# EasyEDA Pro project 物流车.eprj

# Schematic Schematic1
Create Date: 2023-06-04; Page Name: P1; Project Name: 物流车; Schematic Name: Schematic1; Update Date: 2023-06-04; Company: 嘉立创EDA; Page Size: A4; Version: V1.0
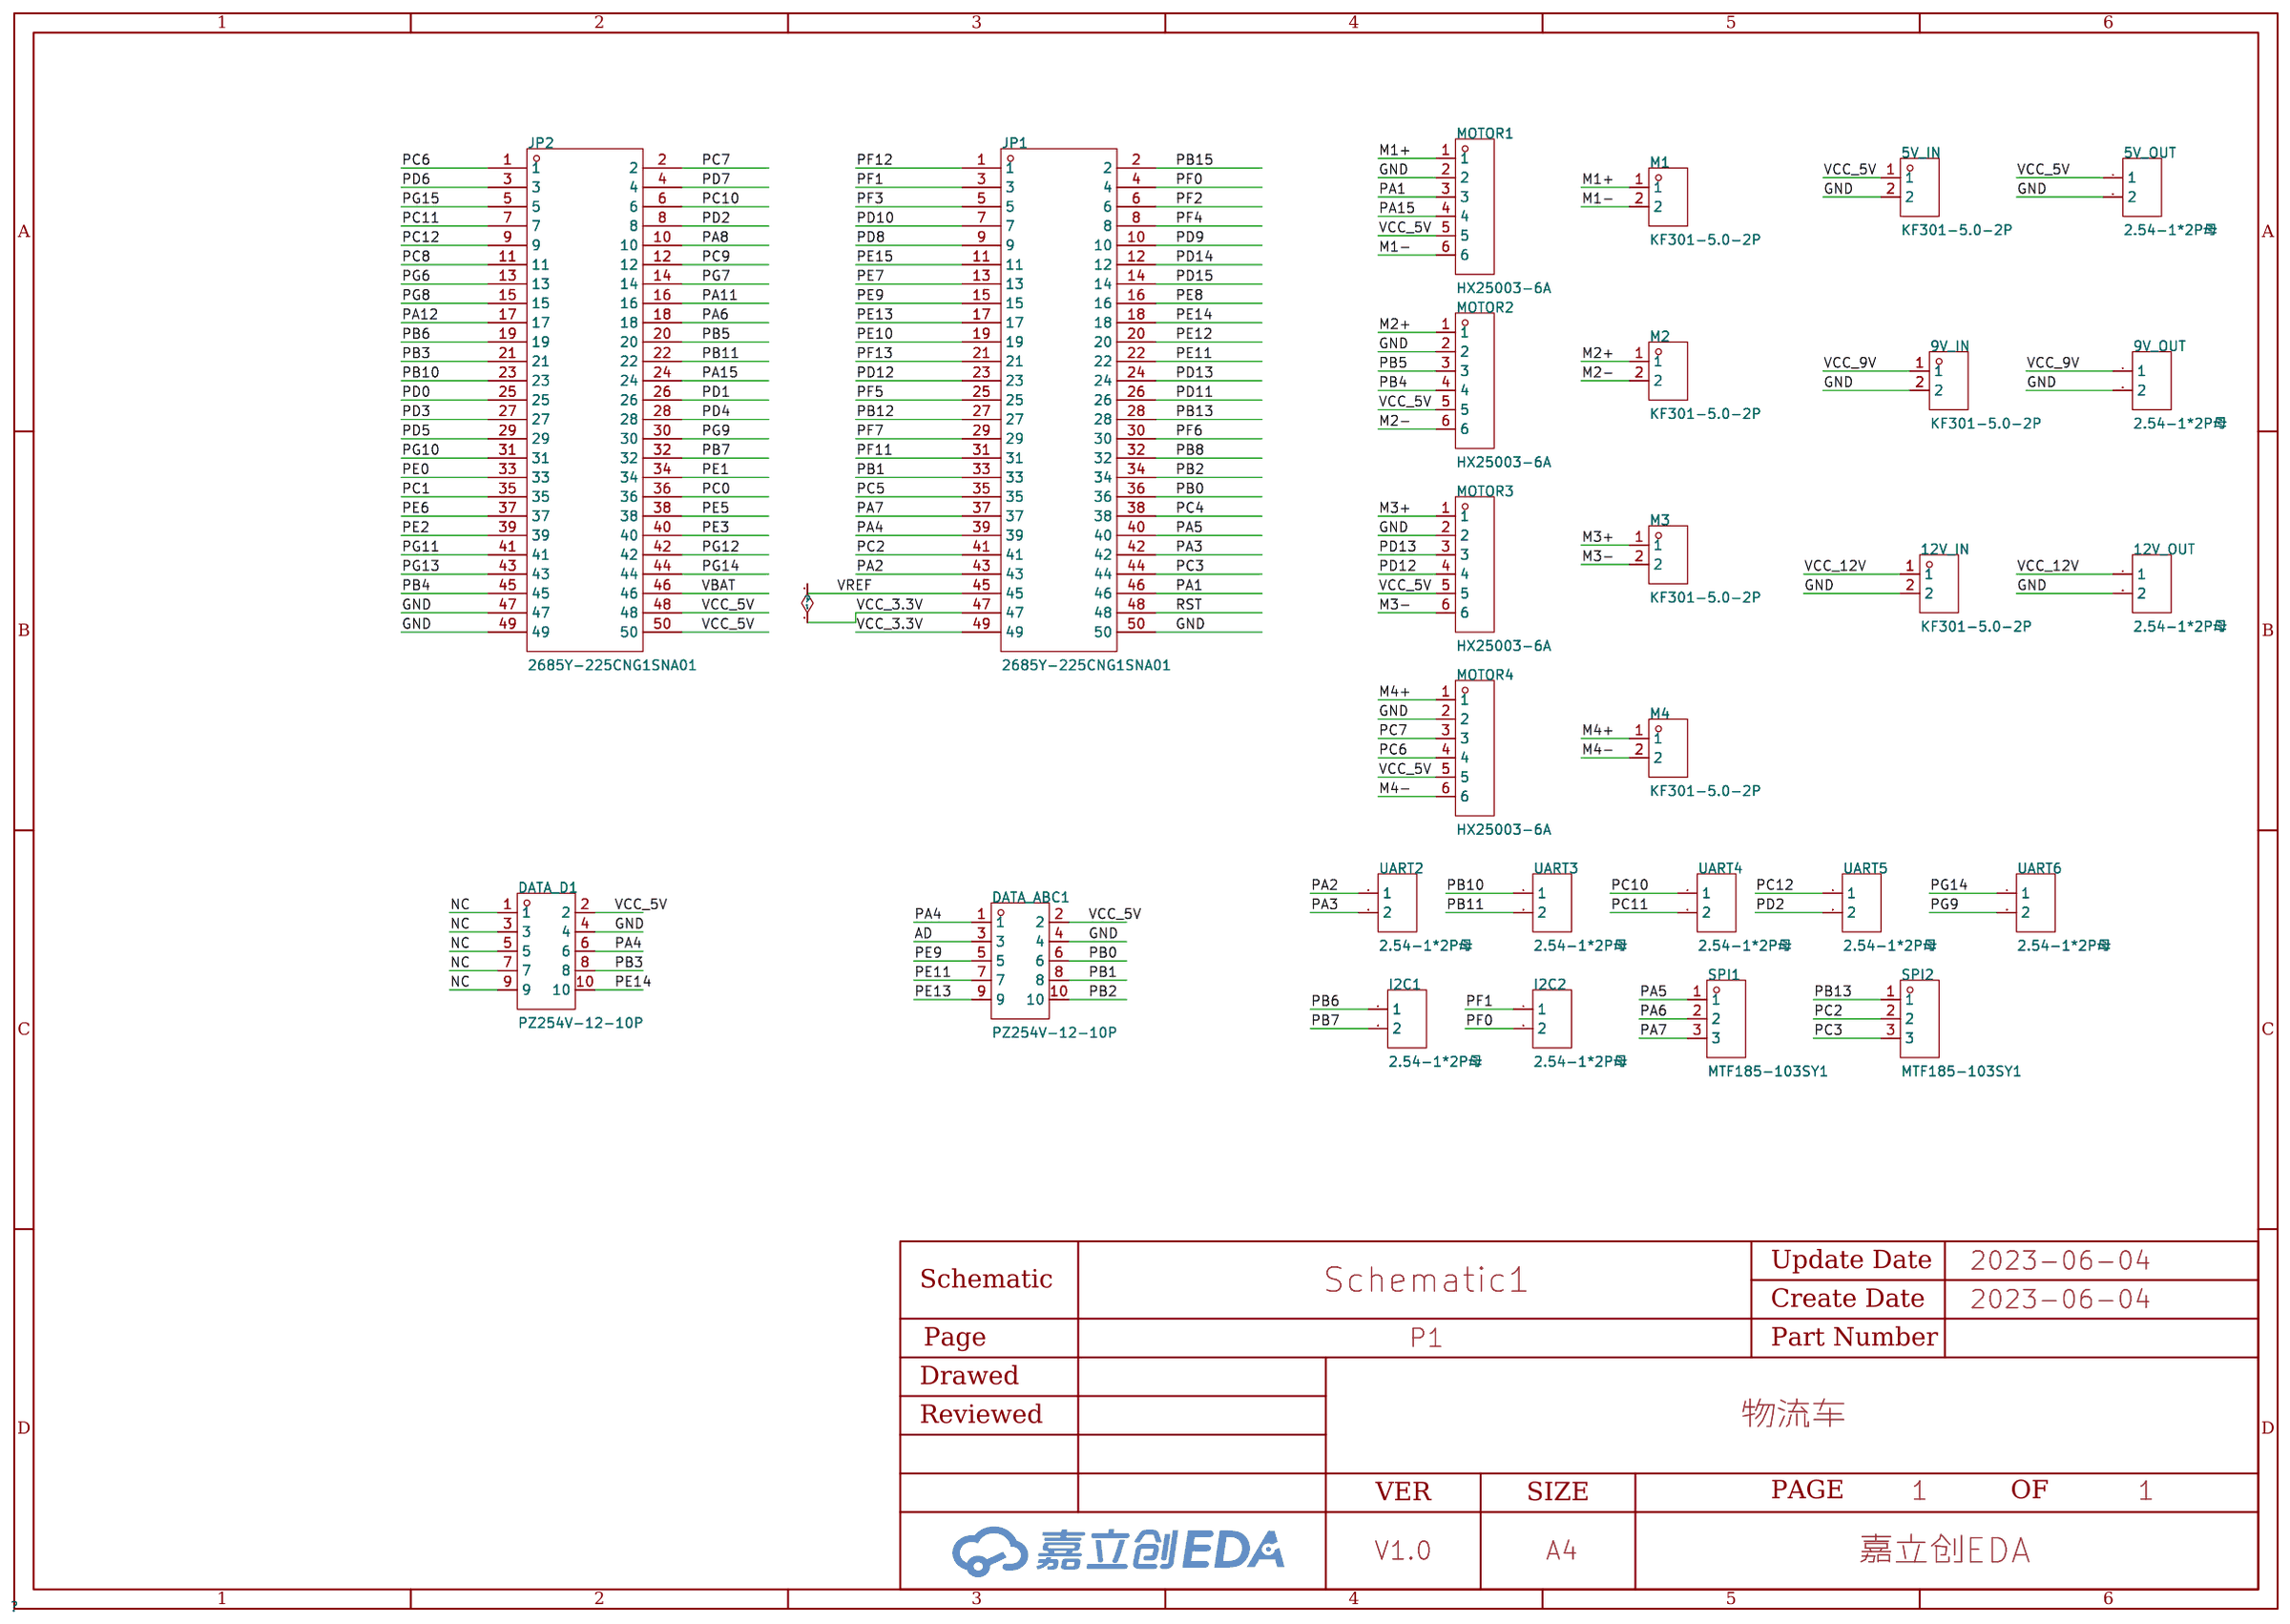
[diagram p0: schematic sheet]

## Parts
5V_IN  KF301-5.0-2P  [CONN-TH_P5.00_KF301-5.0-2P]
5V_OUT  2.54-1*2P母  [HDR-TH_2P-P2.54-V-F]
9V_IN  KF301-5.0-2P  [CONN-TH_P5.00_KF301-5.0-2P]
9V_OUT  2.54-1*2P母  [HDR-TH_2P-P2.54-V-F]
12V_IN  KF301-5.0-2P  [CONN-TH_P5.00_KF301-5.0-2P]
12V_OUT  2.54-1*2P母  [HDR-TH_2P-P2.54-V-F]
DATA_ABC1  PZ254V-12-10P  [HDR-TH_10P-P2.54-V-M-R2-C5-S2.54]
DATA_D1  PZ254V-12-10P  [HDR-TH_10P-P2.54-V-M-R2-C5-S2.54]
I2C1  2.54-1*2P母  [HDR-TH_2P-P2.54-V-F]
I2C2  2.54-1*2P母  [HDR-TH_2P-P2.54-V-F]
JP1  2685Y-225CNG1SNA01  [HDR-TH_50P-P2.54-V-F-R2-C25-S2.54-1]
JP2  2685Y-225CNG1SNA01  [HDR-TH_50P-P2.54-V-F-R2-C25-S2.54-1]
M1  KF301-5.0-2P  [CONN-TH_P5.00_KF301-5.0-2P]
M2  KF301-5.0-2P  [CONN-TH_P5.00_KF301-5.0-2P]
M3  KF301-5.0-2P  [CONN-TH_P5.00_KF301-5.0-2P]
M4  KF301-5.0-2P  [CONN-TH_P5.00_KF301-5.0-2P]
MOTOR1  HX25003-6A  [CONN-TH_6P-P2.50_HX25003-6A]
MOTOR2  HX25003-6A  [CONN-TH_6P-P2.50_HX25003-6A]
MOTOR3  HX25003-6A  [CONN-TH_6P-P2.50_HX25003-6A]
MOTOR4  HX25003-6A  [CONN-TH_6P-P2.50_HX25003-6A]
SPI1  MTF185-103SY1  [HDR-TH_3P-P2.54-V-F]
SPI2  MTF185-103SY1  [HDR-TH_3P-P2.54-V-F]
UART2  2.54-1*2P母  [HDR-TH_2P-P2.54-V-F]
UART3  2.54-1*2P母  [HDR-TH_2P-P2.54-V-F]
UART4  2.54-1*2P母  [HDR-TH_2P-P2.54-V-F]
UART5  2.54-1*2P母  [HDR-TH_2P-P2.54-V-F]
UART6  2.54-1*2P母  [HDR-TH_2P-P2.54-V-F]

## Library data of the parts
5V_IN 9V_IN 12V_IN M1-M4 = KF301-5.0-2P: 间距:5mm;排数:1;每排PIN数:2;安装方式:直针;额定电流:17A;额定电压:250V;线规 - AWG:14~22;线规 - mm?:1.5;工作温度范围:-30℃~+120℃;颜色:蓝色;; LCSC Part Name: 5mm 排数:1 每排P数:2 直针 可拼接 铜 环保; Supplier Part: C474881; Manufacturer: KEFA(科发); Supplier Footprint: 直插,P=5mm; JLCPCB Part Class: Extended Part; Datasheet: https://atta.szlcsc.com/upload/public/pdf/source/20200115/C474881_883EFE2003339C40FD1BEEEFC9A18423.pdf; Supplier: LCSC; Pitch: 5mm; Number of Rows: 1; Number of PINs Per Row: 2; Mounting Style: 直针; Current Rating (Max): 17A; Voltage Rating (Max): 250V; Wire Gauge - AWG: 14~22; Wire Gauge - mm?: 1.5; Operating Temperature Range: -30℃~+120℃; Color: 蓝色
5V_OUT 9V_OUT 12V_OUT I2C1 I2C2 UART2-UART6 = 2.54-1*2P母: 排数:单排;总孔位数:2;间距:2.54mm;插孔结构:1x2P;行距:-;安装类型:直插;塑高:-;触头材质:-;触头镀层:-;; LCSC Part Name: 2.54mm 1x2P; Supplier Part: C49661; Manufacturer: BOOMELE(博穆精密); Supplier Footprint: 直插,P=2.54mm; JLCPCB Part Class: Extended Part; Datasheet: https://atta.szlcsc.com/upload/public/pdf/source/20151109/1457707570988.pdf; Supplier: LCSC; Number of Rows: 单排; Number of Holes: 2; Pitch: 2.54mm; Holes Structure: 1x2P; Mounting Type: 直插
DATA_ABC1 DATA_D1 = PZ254V-12-10P: 排数:双排;总PIN位数:10;间距:2.54mm;插针结构:2x5P;行距:2.54mm;安装类型:直插;圆针/方针:方针;额定电流:-;额定电压:-;配合针长度:6mm;塑高:2.5mm;端接针长度:3mm;触头材质:黄铜;触头镀层:-;工作温度范围:-40℃~+105℃;颜色:黑色;; LCSC Part Name: 2.54mm 2x5P 直插 方针; Supplier Part: C492422; Manufacturer: XFCN(兴飞); Supplier Footprint: 插件,P=2.54mm; JLCPCB Part Class: Extended Part; Datasheet: https://atta.szlcsc.com/upload/public/pdf/source/20200309/C492422_5020CEA01BE7051F9EA9DD81AB0A25E3.pdf; Supplier: LCSC; Number of Rows: 双排; Number of Pins: 10; Pitch: 2.54mm; Pin Structure: 2x5P; Row Spacing: 2.54mm; Mounting Type: 直插; Circluar Pins/Square Pins: 方针; Length of Mating Pin: 6mm; Insulation Height: 2.5mm; Length of End Connection Pin: 3mm; Contact Material: 黄铜; Operating Temperature Range: -40℃~+105℃; Color: 黑色
JP1 JP2 = 2685Y-225CNG1SNA01: 排数:双排;总孔位数:50;间距:2.54mm;插孔结构:2x25P;行距:2.54mm;安装类型:直插;塑高:-;触头材质:黄铜;触头镀层:-;; LCSC Part Name: 2.54mm 2x25P Y型//环保耐高温/镀金; Supplier Part: C350296; Manufacturer: 华宇创; Supplier Footprint: 插件,P=2.54mm; JLCPCB Part Class: Extended Part; Datasheet: https://atta.szlcsc.com/upload/public/pdf/source/20181220/C350296_D2530F60C4B7AD26B2D0A354C76F8429.pdf; Supplier: LCSC; Number of Rows: 双排; Number of Holes: 50; Pitch: 2.54mm; Holes Structure: 2x25P; Row Spacing: 2.54mm; Mounting Type: 直插; Contact Material: 黄铜
MOTOR1-MOTOR4 = HX25003-6A: 参考系列:XH;间距:2.5mm;插针结构:1x6P;排数:1;每排PIN数:6;行距:-;公母:公型插针;安装方式:直插;额定电流:-;工作温度范围:-;; LCSC Part Name: XH 2.5mm 1x6P 直插 母座; Supplier Part: C442303; Manufacturer: HX(红星); Supplier Footprint: 插件,P=2.5mm; JLCPCB Part Class: Extended Part; Datasheet: https://atta.szlcsc.com/upload/public/pdf/source/20191028/C442303_23C4B7729FA712B9F535CAFD67C62AAB.pdf; Supplier: LCSC; Reference Series: XH; Pitch: 2.5mm; Pins Structure: 1x6P; Number of Rows: 1; Number of PINs Per Row: 6; Gender: 公型插针; Mounting Style: 直插
SPI1 SPI2 = MTF185-103SY1: 排数:单排;总孔位数:3;间距:2.54mm;插孔结构:1x3P;行距:-;安装类型:直插;塑高:-;触头材质:-;触头镀层:金;; LCSC Part Name: 2.54mm 1x3P; Supplier Part: C358717; Manufacturer: MINTRON(明硕); Supplier Footprint: 插件,P=2.54mm; JLCPCB Part Class: Extended Part; Datasheet: https://atta.szlcsc.com/upload/public/pdf/source/20190124/C358717_1CD3D4F6D9EF88A46E6D33CC99B8A53E.pdf; Supplier: LCSC; Number of Rows: 单排; Number of Holes: 3; Pitch: 2.54mm; Holes Structure: 1x3P; Mounting Type: 直插; Contact Plating: 金

## Nets
GND: 5V_IN.2 5V_OUT.2 9V_IN.2 9V_OUT.2 12V_IN.2 12V_OUT.2 DATA_ABC1.4 DATA_D1.4 JP1.50 JP2.47 JP2.49 MOTOR1.2 MOTOR2.2 MOTOR3.2 MOTOR4.2
VBAT: JP2.46
VCC_3.3V: JP1.45 JP1.47 JP1.49
VCC_5V: 5V_IN.1 5V_OUT.1 DATA_ABC1.2 DATA_D1.2 JP2.48 JP2.50 MOTOR1.5 MOTOR2.5 MOTOR3.5 MOTOR4.5
VCC_9V: 9V_IN.1 9V_OUT.1
VCC_12V: 12V_IN.1 12V_OUT.1
AD: DATA_ABC1.3
M1+: M1.1 MOTOR1.1
M1-: M1.2 MOTOR1.6
M2+: M2.1 MOTOR2.1
M2-: M2.2 MOTOR2.6
M3+: M3.1 MOTOR3.1
M3-: M3.2 MOTOR3.6
M4+: M4.1 MOTOR4.1
M4-: M4.2 MOTOR4.6
NC: DATA_D1.1 DATA_D1.3 DATA_D1.5 DATA_D1.7 DATA_D1.9
PA1: JP1.46 MOTOR1.3
PA2: JP1.43 UART2.1
PA3: JP1.42 UART2.2
PA4: DATA_ABC1.1 DATA_D1.6 JP1.39
PA5: JP1.40 SPI1.1
PA6: JP2.18 SPI1.2
PA7: JP1.37 SPI1.3
PA8: JP2.10
PA11: JP2.16
PA12: JP2.17
PA15: JP2.24 MOTOR1.4
PB0: DATA_ABC1.6 JP1.36
PB1: DATA_ABC1.8 JP1.33
PB2: DATA_ABC1.10 JP1.34
PB3: DATA_D1.8 JP2.21
PB4: JP2.45 MOTOR2.4
PB5: JP2.20 MOTOR2.3
PB6: I2C1.1 JP2.19
PB7: I2C1.2 JP2.32
PB8: JP1.32
PB10: JP2.23 UART3.1
PB11: JP2.22 UART3.2
PB12: JP1.27
PB13: JP1.28 SPI2.1
PB15: JP1.2
PC0: JP2.36
PC1: JP2.35
PC2: JP1.41 SPI2.2
PC3: JP1.44 SPI2.3
PC4: JP1.38
PC5: JP1.35
PC6: JP2.1 MOTOR4.4
PC7: JP2.2 MOTOR4.3
PC8: JP2.11
PC9: JP2.12
PC10: JP2.6 UART4.1
PC11: JP2.7 UART4.2
PC12: JP2.9 UART5.1
PD0: JP2.25
PD1: JP2.26
PD2: JP2.8 UART5.2
PD3: JP2.27
PD4: JP2.28
PD5: JP2.29
PD6: JP2.3
PD7: JP2.4
PD8: JP1.9
PD9: JP1.10
PD10: JP1.7
PD11: JP1.26
PD12: JP1.23 MOTOR3.4
PD13: JP1.24 MOTOR3.3
PD14: JP1.12
PD15: JP1.14
PE0: JP2.33
PE1: JP2.34
PE2: JP2.39
PE3: JP2.40
PE5: JP2.38
PE6: JP2.37
PE7: JP1.13
PE8: JP1.16
PE9: DATA_ABC1.5 JP1.15
PE10: JP1.19
PE11: DATA_ABC1.7 JP1.22
PE12: JP1.20
PE13: DATA_ABC1.9 JP1.17
PE14: DATA_D1.10 JP1.18
PE15: JP1.11
PF0: I2C2.2 JP1.4
PF1: I2C2.1 JP1.3
PF2: JP1.6
PF3: JP1.5
PF4: JP1.8
PF5: JP1.25
PF6: JP1.30
PF7: JP1.29
PF11: JP1.31
PF12: JP1.1
PF13: JP1.21
PG6: JP2.13
PG7: JP2.14
PG8: JP2.15
PG9: JP2.30 UART6.2
PG10: JP2.31
PG11: JP2.41
PG12: JP2.42
PG13: JP2.43
PG14: JP2.44 UART6.1
PG15: JP2.5
RST: JP1.48

# Board PCB1
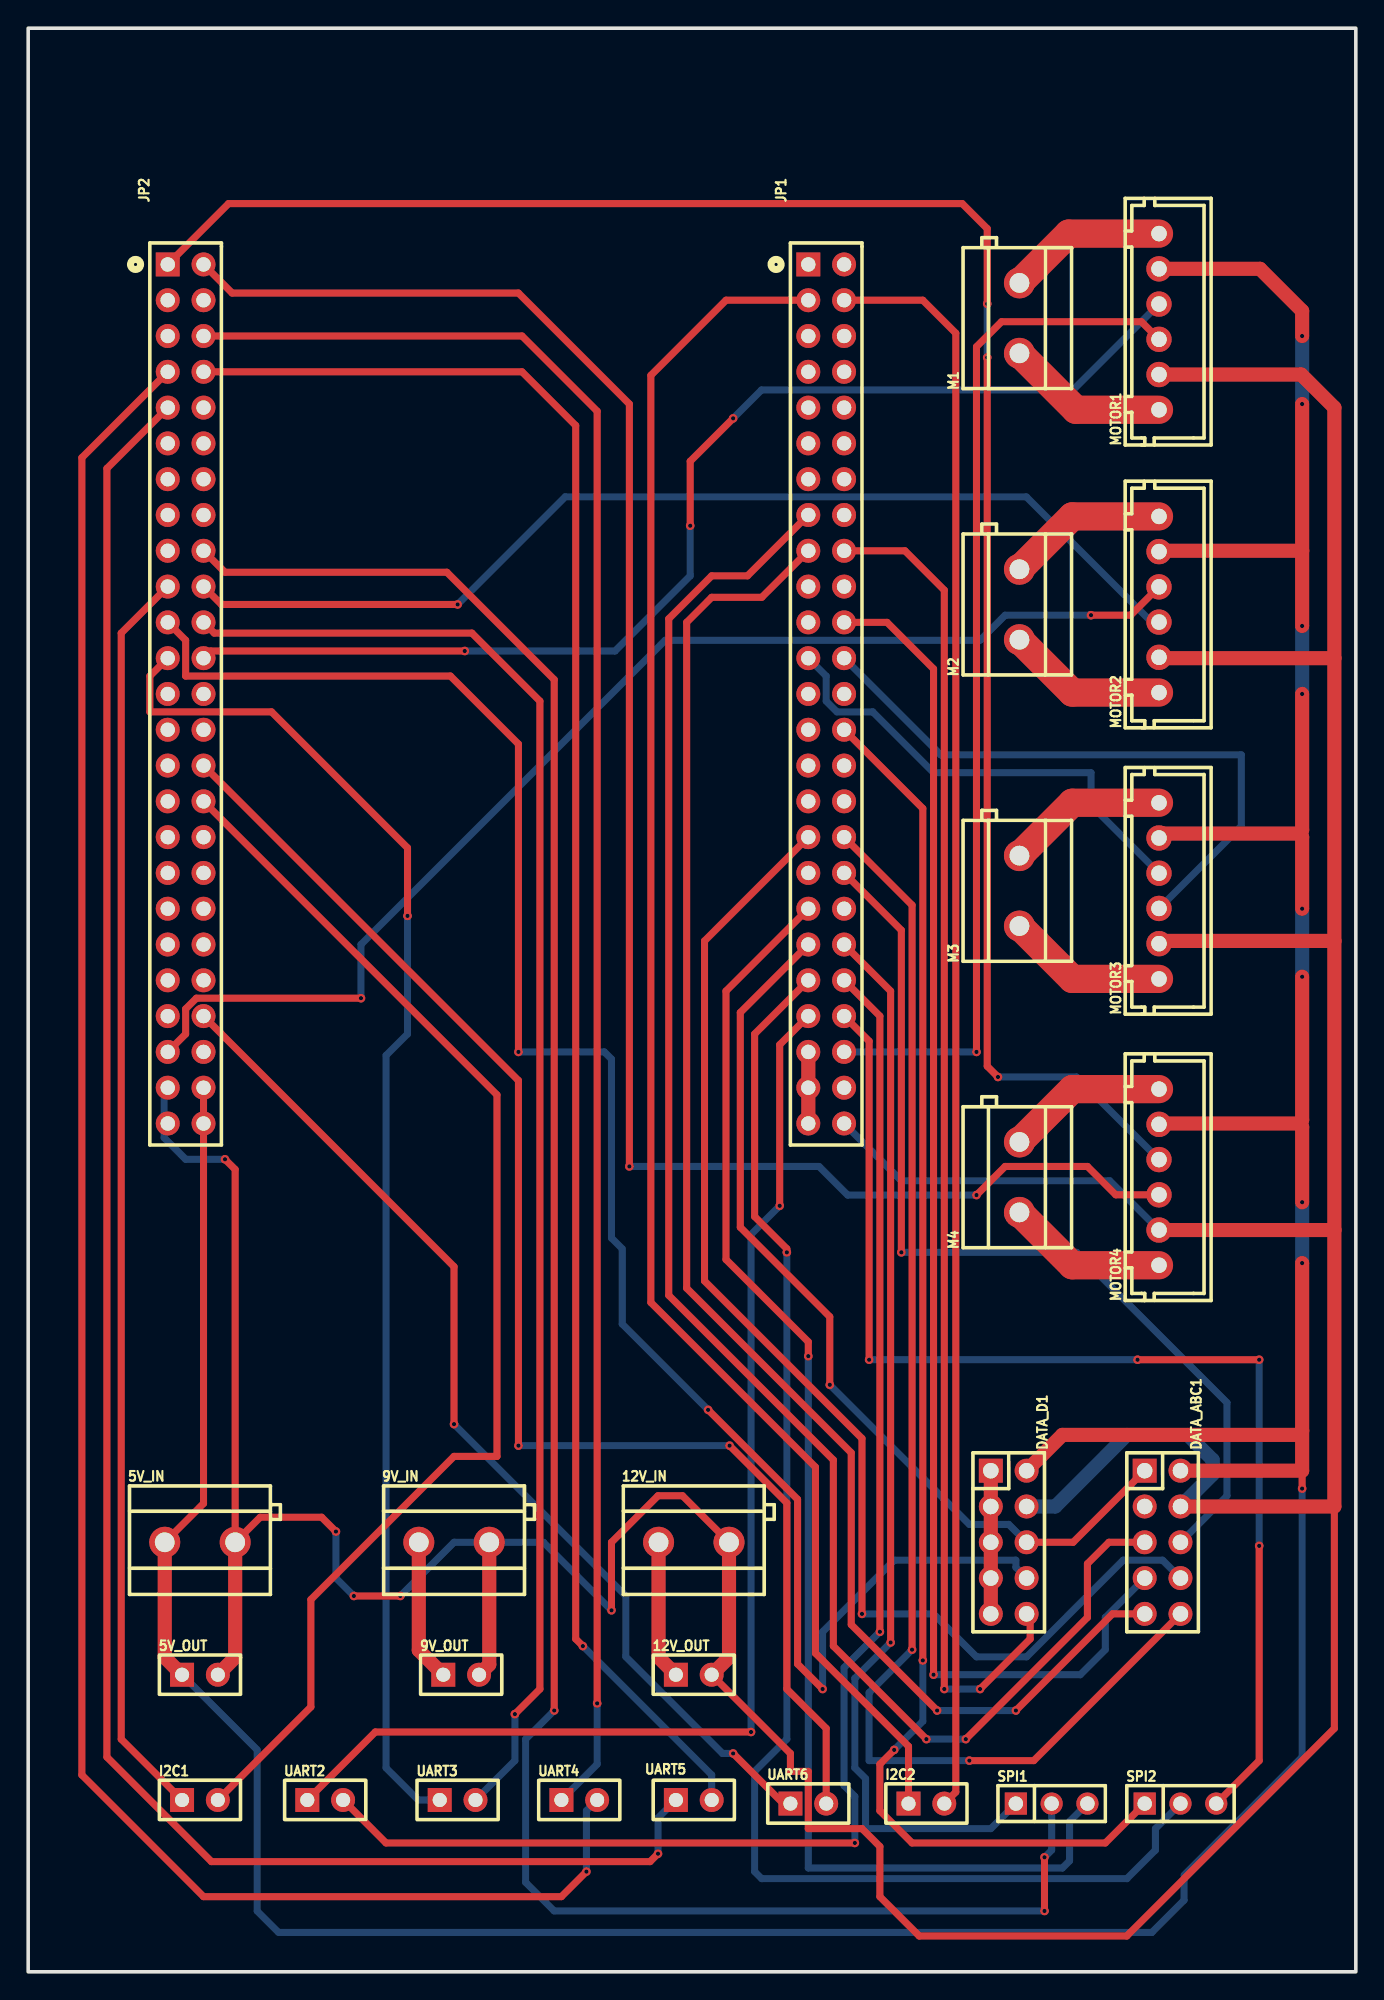
[diagram p1: board, top side]
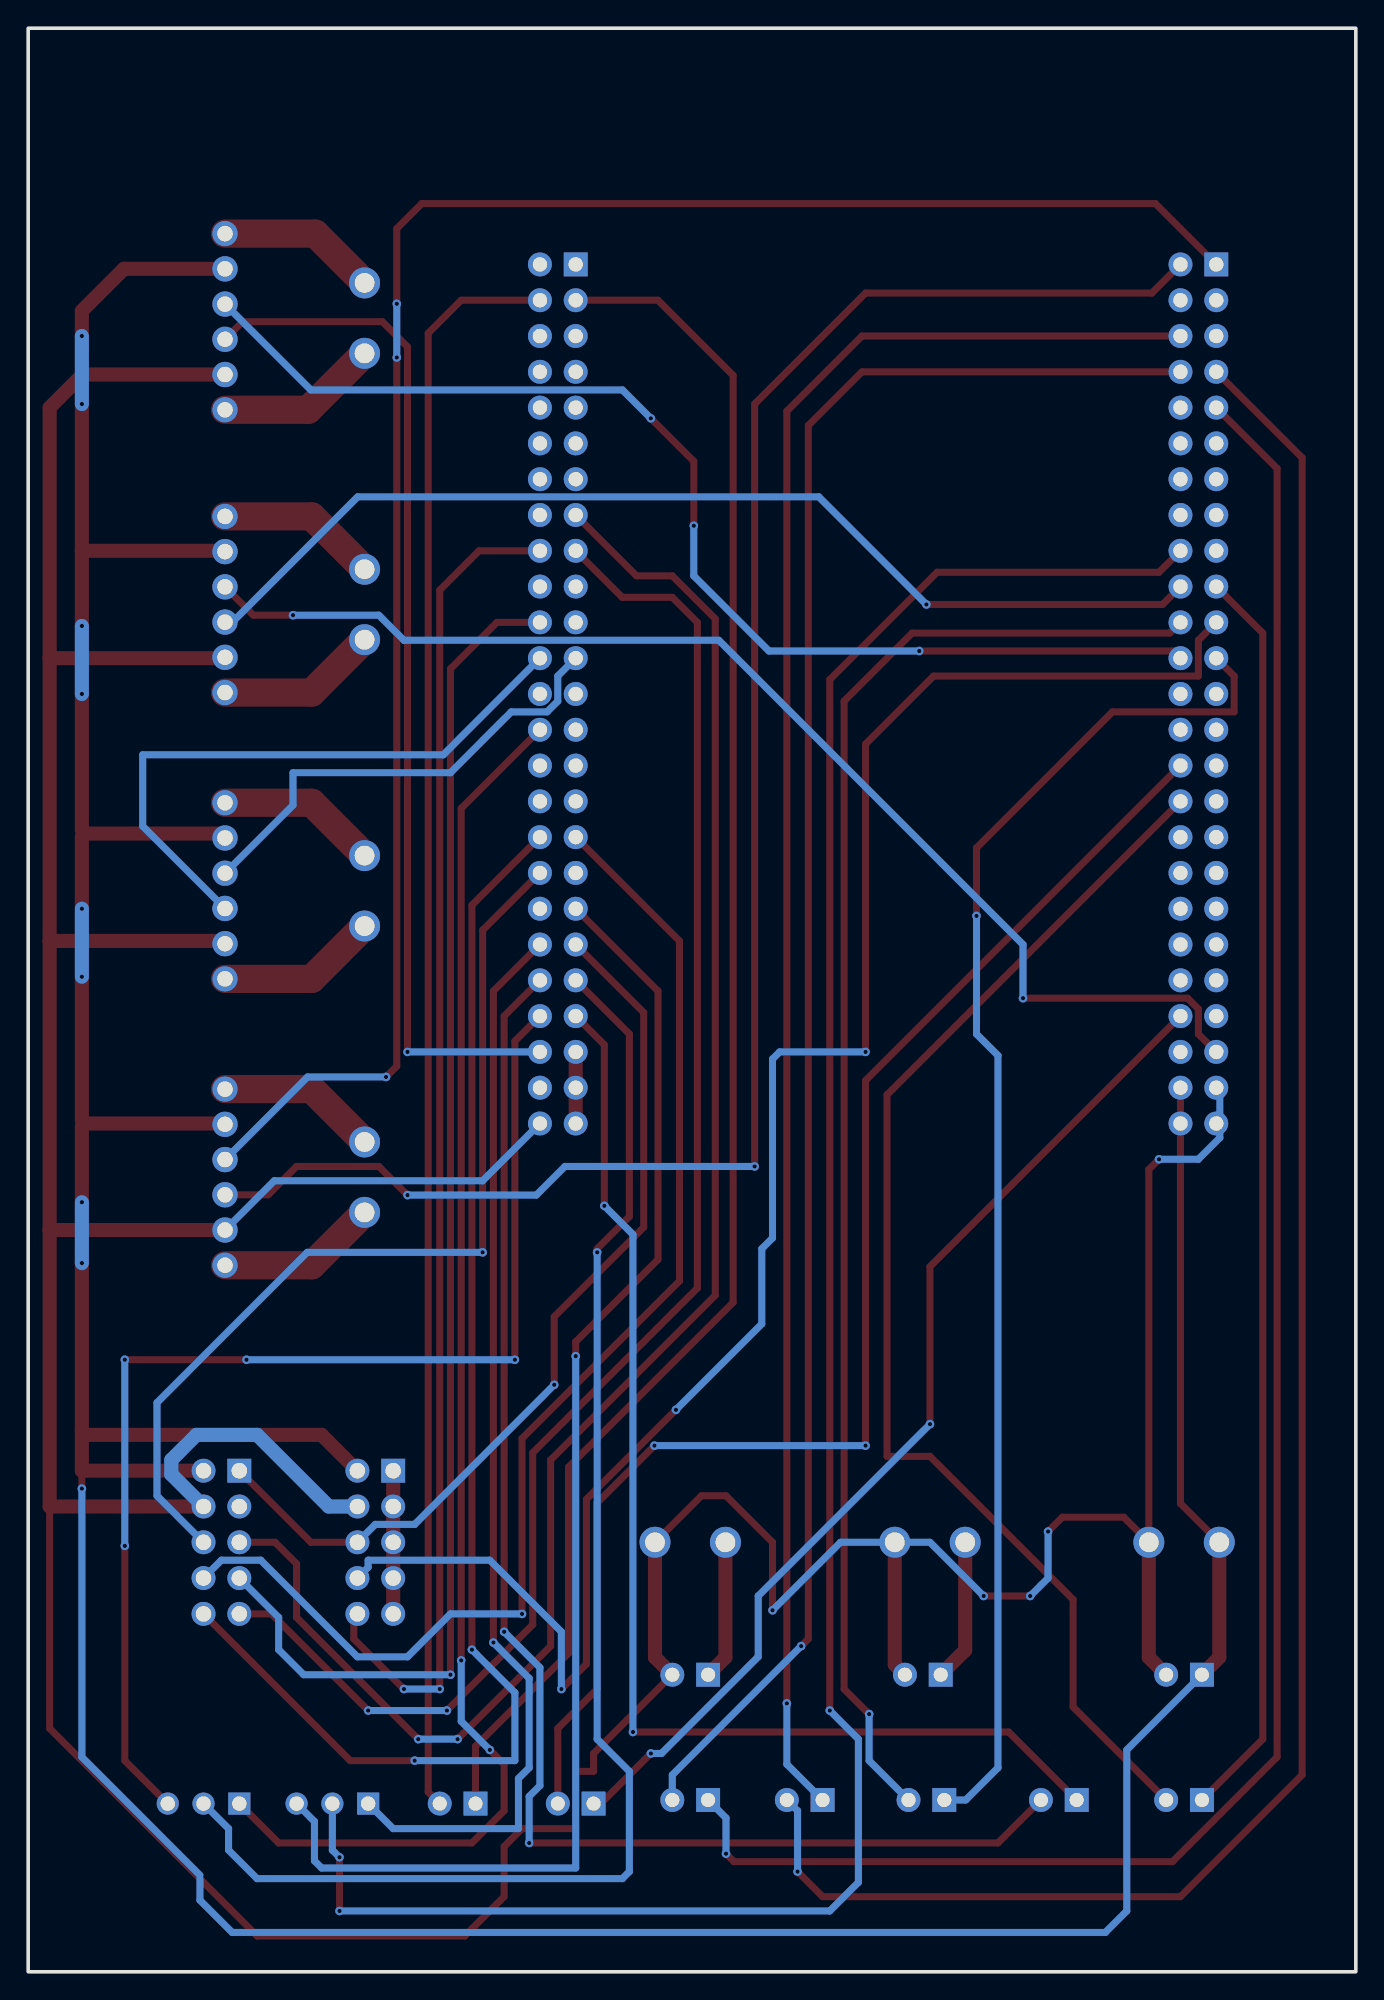
[diagram p2: board, bottom side, seen from below]

Outline 94.23 x 137.92 mm; copper layers: Top Layer, Bottom Layer. Coordinates in mm from the lower left corner of the outline.
Outline path: rectangle 0,137.92 94.23,0
Stack: Top Layer 0.035mm / Dielectric1 1.51mm FR4 er 4.5 / Bottom Layer 0.035mm

## Design rules (mm)
template: JLCPCB Capability(Two Layers Board)
spacing copperThickness1oz (default): track to track 0.102, other pairs 0.152 to 0.3
spacing copperThickness2oz: track to track 0.203, other pairs 0.152 to 0.3
track width copperThickness1oz (default): min 0.127, default 0.254, max 2.54
track width copperThickness2oz: min 0.203, default 0.254, max 2.54
differential pair differentialPair (default): width min 0.127, default 0.254, max 2.54; gap min 0.152, default 0.152
via viaSize (default): diameter min 0.5, default 0.61, max 10; hole min 0.3, default 0.305, max 6.3

## Placement (name value [footprint] x y rotation side)
5V_IN  KF301-5.0-2P  [CONN-TH_P5.00_KF301-5.0-2P]  12.19 30.48 0 top
5V_OUT  2.54-1*2P母  [HDR-TH_2P-P2.54-V-F]  12.19 21.08 0 top
9V_IN  KF301-5.0-2P  [CONN-TH_P5.00_KF301-5.0-2P]  30.23 30.48 0 top
9V_OUT  2.54-1*2P母  [HDR-TH_2P-P2.54-V-F]  30.73 21.08 0 top
12V_IN  KF301-5.0-2P  [CONN-TH_P5.00_KF301-5.0-2P]  47.24 30.48 0 top
12V_OUT  2.54-1*2P母  [HDR-TH_2P-P2.54-V-F]  47.24 21.08 0 top
DATA_ABC1  PZ254V-12-10P  [HDR-TH_10P-P2.54-V-M-R2-C5-S2.54]  80.52 30.48 270 top
DATA_D1  PZ254V-12-10P  [HDR-TH_10P-P2.54-V-M-R2-C5-S2.54]  69.6 30.48 270 top
I2C1  2.54-1*2P母  [HDR-TH_2P-P2.54-V-F]  12.19 12.19 0 top
I2C2  2.54-1*2P母  [HDR-TH_2P-P2.54-V-F]  63.75 11.94 0 top
JP1  2685Y-225CNG1SNA01  [HDR-TH_50P-P2.54-V-F-R2-C25-S2.54-1]  56.64 90.68 270 top
JP2  2685Y-225CNG1SNA01  [HDR-TH_50P-P2.54-V-F-R2-C25-S2.54-1]  11.18 90.68 270 top
M1  KF301-5.0-2P  [CONN-TH_P5.00_KF301-5.0-2P]  70.36 117.35 90 top
M2  KF301-5.0-2P  [CONN-TH_P5.00_KF301-5.0-2P]  70.36 97.03 90 top
M3  KF301-5.0-2P  [CONN-TH_P5.00_KF301-5.0-2P]  70.36 76.71 90 top
M4  KF301-5.0-2P  [CONN-TH_P5.00_KF301-5.0-2P]  70.36 56.39 90 top
MOTOR1  HX25003-6A  [CONN-TH_6P-P2.50_HX25003-6A]  80.26 117.09 90 top
MOTOR2  HX25003-6A  [CONN-TH_6P-P2.50_HX25003-6A]  80.26 97.03 90 top
MOTOR3  HX25003-6A  [CONN-TH_6P-P2.50_HX25003-6A]  80.26 76.71 90 top
MOTOR4  HX25003-6A  [CONN-TH_6P-P2.50_HX25003-6A]  80.26 56.39 90 top
SPI1  MTF185-103SY1  [HDR-TH_3P-P2.54-V-F]  72.64 11.94 0 top
SPI2  MTF185-103SY1  [HDR-TH_3P-P2.54-V-F]  81.79 11.94 0 top
UART2  2.54-1*2P母  [HDR-TH_2P-P2.54-V-F]  21.08 12.19 0 top
UART3  2.54-1*2P母  [HDR-TH_2P-P2.54-V-F]  30.48 12.19 0 top
UART4  2.54-1*2P母  [HDR-TH_2P-P2.54-V-F]  39.12 12.19 0 top
UART5  2.54-1*2P母  [HDR-TH_2P-P2.54-V-F]  47.24 12.19 0 top
UART6  2.54-1*2P母  [HDR-TH_2P-P2.54-V-F]  55.37 11.94 0 top

## Footprints (pads in the part's own frame, mm; a bottom-side part is the same pattern mirrored in y, then rotated)
CONN-TH_6P-P2.50_HX25003-6A
  round 1.8 hole 1.1: 1(-6.25,0) 2(-3.75,0) 3(-1.25,0) 4(1.25,0) 5(3.75,0) 6(6.25,0)
CONN-TH_P5.00_KF301-5.0-2P
  round 2.2 hole 1.4: 1(-2.5,0) 2(2.5,0)
HDR-TH_2P-P2.54-V-F
  rect 1.7x1.7 hole 1: 1(-1.27,0)
  round 1.7 hole 1: 2(1.27,0)
HDR-TH_3P-P2.54-V-F
  rect 1.575x1.575 hole 1.02: 1(-2.54,0)
  round 1.575 hole 1.02: 2(0,0) 3(2.54,0)
HDR-TH_10P-P2.54-V-M-R2-C5-S2.54
  rect 1.7x1.7 hole 1.1: 1(-5.08,-1.27)
  round 1.7 hole 1.1: 2(-5.08,1.27) 3(-2.54,-1.27) 4(-2.54,1.27) 5(0,-1.27) 6(0,1.27) 7(2.54,-1.27) 8(2.54,1.27) 9(5.08,-1.27) 10(5.08,1.27)
HDR-TH_50P-P2.54-V-F-R2-C25-S2.54-1
  rect 1.7x1.7 hole 1.02: 1(-30.48,-1.27)
  round 1.7 hole 1.02: 2(-30.48,1.27) 3(-27.94,-1.27) 4(-27.94,1.27) 5(-25.4,-1.27) 6(-25.4,1.27) 7(-22.86,-1.27) 8(-22.86,1.27) 9(-20.32,-1.27) 10(-20.32,1.27) 11(-17.78,-1.27) 12(-17.78,1.27) 13(-15.24,-1.27) 14(-15.24,1.27) 15(-12.7,-1.27) 16(-12.7,1.27) 17(-10.16,-1.27) 18(-10.16,1.27) 19(-7.62,-1.27) 20(-7.62,1.27) 21(-5.08,-1.27) 22(-5.08,1.27) 23(-2.54,-1.27) 24(-2.54,1.27) 25(0,-1.27) 26(0,1.27) 27(2.54,-1.27) 28(2.54,1.27) 29(5.08,-1.27) 30(5.08,1.27) 31(7.62,-1.27) 32(7.62,1.27) 33(10.16,-1.27) 34(10.16,1.27) 35(12.7,-1.27) 36(12.7,1.27) 37(15.24,-1.27) 38(15.24,1.27) 39(17.78,-1.27) 40(17.78,1.27) 41(20.32,-1.27) 42(20.32,1.27) 43(22.86,-1.27) 44(22.86,1.27) 45(25.4,-1.27) 46(25.4,1.27) 47(27.94,-1.27) 48(27.94,1.27) 49(30.48,-1.27) 50(30.48,1.27)

## Nets
As in the schematic.

## Via types
v1: diameter 0.61, hole 0.305, Top Layer to Bottom Layer, 68 vias

## Routing (per net, layer and track width the routed paths; a pad name or vN(x,y) marks a point on that pad's centre or on a via; arc(x,y) is an arc through that point)
GND: length 381.3
  Top Layer w0.5: 12V_OUT.2 54.1,15.49 54.1,14.22 55.37,14.22 55.37,10.16 59.18,10.16 60.45,8.89 60.45,5.33 63.25,2.54 77.98,2.54 92.71,17.27 92.71,33.02 ; 12V_IN.2 46.44,33.78 44.7,33.78 41.4,30.48 v1(41.4,25.65) ; v1(23.11,26.67) v1(26.42,26.67) ; v1(21.84,31.24) 20.83,32.26 16.47,32.26 5V_IN.2 14.69,56.94 v1(13.97,57.66)
  Top Layer w1: MOTOR1.2 90.36,113.34 92.71,111 92.71,93.22 ; 92.71,52.64 92.71,33.02 DATA_ABC1.4 ; 92.71,52.64 MOTOR4.2 ; 92.71,52.64 92.71,73.15 ; 9V_OUT.2 32.73,21.8 9V_IN.2 ; 12V_OUT.2 49.74,22.31 12V_IN.2 ; 92.71,73.15 80.46,73.15 MOTOR3.2 ; 92.71,73.15 92.71,93.22 ; 5V_OUT.2 14.69,22.31 5V_IN.2 ; 92.71,93.22 80.32,93.22 MOTOR2.2
  Bottom Layer w0.5: v1(13.97,57.66) 11.18,57.66 9.65,59.18 9.65,62.48 JP2.47 ; JP1.50 61.98,56.13 76.77,56.13 MOTOR4.2 ; v1(26.42,26.67) 30.23,30.48 9V_IN.2 36.58,30.48 v1(41.4,25.65) ; v1(21.84,31.24) 21.84,27.94 v1(23.11,26.67)
  Bottom Layer w1: DATA_ABC1.4 84.07,35.31 84.07,36.32 82.3,38.1 77.98,38.1 72.9,33.02 DATA_D1.4
VCC_3.3V: length 5.1
  Top Layer w1: JP1.45 JP1.47 JP1.49
VCC_5V: length 317
  Top Layer w0.5: 5V_IN.1 12.45,33.23 JP2.50 JP2.48 ; v1(90.42,34.29) 90.42,35.56
  Top Layer w1: 90.17,80.77 80.58,80.77 MOTOR3.5 ; 90.17,80.77 90.42,81.03 v1(90.42,90.68) ; 90.17,80.77 90.42,80.52 v1(90.42,75.44) ; 90.42,38.4 90.12,38.1 73.41,38.1 DATA_D1.2 ; 90.42,38.4 90.42,35.56 DATA_ABC1.2 ; 90.42,38.4 v1(90.42,50.29) ; 90.17,60.2 90.42,60.45 v1(90.42,70.61) ; 90.17,60.2 80.32,60.2 MOTOR4.5 ; 90.17,60.2 90.42,59.94 v1(90.42,54.61) ; 90.42,100.84 80.32,100.84 MOTOR2.5 ; 90.42,100.84 v1(90.42,95.5) ; 90.42,100.84 v1(90.42,111.25) ; MOTOR1.5 87.44,120.84 90.42,117.86 v1(90.42,116.08) ; 5V_IN.1 9.69,22.31 5V_OUT.1
  Bottom Layer w0.5: v1(90.42,34.29) 90.42,15.24 82.04,6.86 ; 5V_OUT.1 16.26,15.75 16.26,4.32 17.78,2.79 79.76,2.79 82.04,5.08 82.04,6.6
  Bottom Layer w1: v1(90.42,116.08) v1(90.42,111.25) ; v1(90.42,50.29) v1(90.42,54.61) ; v1(90.42,70.61) v1(90.42,75.44) ; v1(90.42,90.68) v1(90.42,95.5)
VCC_9V: length 10.1
  Top Layer w1: 9V_IN.1 27.73,22.82 9V_OUT.1
VCC_12V: length 9.9
  Top Layer w1: 12V_OUT.1 44.74,22.31 12V_IN.1
M1+: length 11.6
  Top Layer w2: MOTOR1.1 74.36,110.84 M1.1
M1-: length 11.4
  Top Layer w2: M1.2 73.85,123.34 MOTOR1.6
M2+: length 11.5
  Top Layer w2: MOTOR2.1 74.11,90.78 M2.1
M2-: length 11.5
  Top Layer w2: MOTOR2.6 74.11,103.28 M2.2
M3+: length 11.5
  Top Layer w2: MOTOR3.1 74.11,70.46 M3.1
M3-: length 11.5
  Top Layer w2: MOTOR3.6 74.11,82.96 M3.2
M4+: length 11.5
  Top Layer w2: MOTOR4.1 74.11,50.14 M4.1
M4-: length 11.5
  Top Layer w2: M4.2 74.11,62.64 MOTOR4.6
NC: length 10.2
  Top Layer w1: DATA_D1.9 DATA_D1.7 DATA_D1.5 DATA_D1.3 DATA_D1.1
PA1: length 73.6
  Top Layer w0.5: v1(67.31,65.28) 67.31,115.32 69.09,117.09 79.01,117.09 MOTOR1.3
  Bottom Layer w0.5: JP1.46 v1(67.31,65.28)
PA2: length 86
  Top Layer w0.5: v1(53.34,54.36) 53.34,65.79 JP1.43 ; v1(51.31,17.02) 24.64,17.02 UART2.1
  Bottom Layer w0.5: v1(51.31,17.02) 51.31,52.32 v1(53.34,54.36)
PA3: length 101.2
  Top Layer w0.5: v1(58.67,9.14) 25.4,9.14 UART2.2 ; v1(60.45,24.13) 60.45,67.82 JP1.42
  Bottom Layer w0.5: v1(58.67,9.14) 58.67,12.45 57.91,13.21 57.91,21.59 v1(60.45,24.13)
PA4: length 65
  Top Layer w0.5: v1(56.9,41.66) 56.9,46.48 50.55,52.83 50.55,68.07 JP1.39 ; DATA_ABC1.1 74.17,30.48 DATA_D1.6
  Bottom Layer w0.5: DATA_D1.6 69.6,31.75 66.8,31.75 v1(56.9,41.66)
PA5: length 76.9
  Top Layer w0.5: JP1.40 61.21,69.6 v1(61.21,23.37)
  Bottom Layer w0.5: v1(61.21,23.37) 58.67,20.83 58.67,14.48 59.44,13.72 59.44,10.16 68.33,10.16 SPI1.1
PA6: length 160.4
  Top Layer w0.5: v1(37.34,18.54) 37.34,91.69 29.72,99.31 13.97,99.31 JP2.18 ; v1(72.14,4.32) v1(72.14,8.13)
  Bottom Layer w0.5: v1(72.14,8.13) 72.64,8.64 SPI1.2 ; v1(72.14,4.32) 37.34,4.32 35.31,6.35 35.31,16.51 v1(37.34,18.54)
PA7: length 96.3
  Top Layer w0.5: v1(55.37,43.69) 55.37,44.7 49.53,50.55 49.53,69.6 JP1.37
  Bottom Layer w0.5: v1(55.37,43.69) 55.37,7.37 73.41,7.37 73.91,7.87 73.91,10.67 SPI1.3
PA15: length 83
  Top Layer w0.5: v1(30.99,93.73) 12.95,93.73 JP2.24 ; v1(46.99,102.62) 46.99,107.19 v1(50.04,110.24)
  Bottom Layer w0.5: v1(50.04,110.24) 52.05,112.25 74.17,112.25 MOTOR1.4 ; v1(46.99,102.62) 46.99,99.06 41.66,93.73 v1(30.99,93.73)
PB0: length 67.4
  Top Layer w0.5: v1(61.98,51.05) 61.98,73.91 JP1.36
  Bottom Layer w0.5: v1(61.98,51.05) 74.42,51.05 85.09,40.39 85.09,33.78 DATA_ABC1.6
PB1: length 90
  Top Layer w0.5: v1(59.18,25.4) 59.18,37.85 48.01,49.02 48.01,73.15 v1(55.37,80.52)
  Bottom Layer w0.5: v1(59.18,25.4) 64.26,25.4 67.31,22.35 70.87,22.35 77.72,29.21 80.52,29.21 DATA_ABC1.8
PB2: length 95.2
  Top Layer w0.5: v1(62.74,22.86) 62.74,75.69 JP1.34 ; v1(66.8,14.99) 71.37,14.99 DATA_ABC1.10
  Bottom Layer w0.5: v1(66.8,14.99) 59.69,14.99 59.69,19.81 v1(62.74,22.86)
PB3: length 131
  Top Layer w0.5: v1(34.8,65.28) 34.8,87.12 29.97,91.95 11.18,91.95 11.18,94.49 JP2.21 ; v1(56.39,20.07) 54.61,21.84 54.61,33.53 v1(48.26,39.88)
  Bottom Layer w0.5: v1(48.26,39.88) 42.16,45.97 42.16,51.31 41.4,52.07 41.4,64.77 40.89,65.28 v1(34.8,65.28) ; v1(56.39,20.07) 56.39,24.13 61.47,29.21 70.1,29.21 70.1,28.7 DATA_D1.8
PB4: length 87.3
  Top Layer w0.5: v1(75.44,96.27) 78.25,96.27 MOTOR2.4 ; JP2.45 11.18,66.55 11.18,68.33 11.94,69.09 v1(23.62,69.09)
  Bottom Layer w0.5: v1(23.62,69.09) 23.62,72.9 45.21,94.49 67.56,94.49 69.34,96.27 v1(75.44,96.27)
PB5: length 75.2
  Top Layer w0.5: v1(30.48,97.03) 13.72,97.03 JP2.20
  Bottom Layer w0.5: v1(30.48,97.03) 38.12,104.67 70.85,104.67 79.74,95.78 MOTOR2.3
PB6: length 89.3
  Top Layer w0.5: I2C1.1 6.6,16.51 6.6,95 JP2.19
PB7: length 89.5
  Top Layer w0.5: JP2.32 33.27,62.23 33.27,36.58 30.23,36.58 20.07,26.42 20.07,18.8 I2C1.2
PB10: length 97.3
  Top Layer w0.5: v1(26.92,74.93) 26.92,79.76 17.27,89.41 8.64,89.41 8.64,91.95 JP2.23
  Bottom Layer w0.5: UART3.1 27.69,12.19 25.4,14.48 25.4,65.02 26.92,66.55 v1(26.92,74.93)
PB11: length 106.1
  Top Layer w0.5: JP2.22 13.21,95 31.5,95 36.32,90.17 36.32,20.07 v1(34.54,18.29)
  Bottom Layer w0.5: UART3.2 34.54,14.99 v1(34.54,18.29)
PB13: length 101.2
  Top Layer w0.5: v1(63.5,22.1) 63.5,82.55 JP1.28 ; v1(61.47,15.75) 60.45,14.73 60.45,11.43 62.74,9.14 76.45,9.14 SPI2.1
  Bottom Layer w0.5: v1(63.5,22.1) 63.5,17.78 v1(61.47,15.75)
PC2: length 100.2
  Top Layer w0.5: JP1.41 51.56,66.55 51.56,53.59 53.85,51.31 v1(53.85,51.05)
  Bottom Layer w0.5: v1(53.85,51.05) 53.85,16.51 51.56,14.22 51.56,7.11 52.06,6.61 77.99,6.61 80.01,8.64 80.01,10.16 SPI2.2
PC3: length 85.6
  Top Layer w0.5: v1(78.74,43.43) v1(87.38,43.43) ; JP1.44 59.69,66.04 v1(59.69,43.43) ; SPI2.3 87.38,14.99 v1(87.38,30.23)
  Bottom Layer w0.5: v1(87.38,43.43) v1(87.38,30.23) ; v1(59.69,43.43) v1(78.74,43.43)
PC6: length 135.1
  Top Layer w0.5: v1(68.07,118.36) 68.07,123.7 66.29,125.48 14.22,125.48 JP2.1 ; v1(68.07,114.55) 68.07,64.26 v1(68.83,63.5)
  Bottom Layer w0.5: v1(68.83,63.5) 74.4,63.5 MOTOR4.4 ; v1(68.07,118.36) v1(68.07,114.55)
PC7: length 128.5
  Top Layer w0.5: v1(42.67,57.15) 42.67,111.25 34.8,119.13 14.48,119.13 JP2.2 ; v1(67.31,55.12) 69.34,57.15 75.18,57.15 77.2,55.14 MOTOR4.3
  Bottom Layer w0.5: v1(67.31,55.12) 58.17,55.12 56.13,57.15 v1(42.67,57.15)
PC10: length 129.8
  Top Layer w0.5: v1(40.39,19.05) 40.39,110.74 35.05,116.08 JP2.6
  Bottom Layer w0.5: v1(40.39,19.05) 40.39,14.73 UART4.1
PC11: length 147.6
  Top Layer w0.5: v1(39.62,7.11) 37.85,5.33 12.45,5.33 3.81,13.97 3.81,107.44 JP2.7
  Bottom Layer w0.5: UART4.2 39.62,11.43 v1(39.62,7.11)
PC12: length 144.3
  Top Layer w0.5: v1(44.7,8.38) 44.14,7.82 13.01,7.82 5.59,15.24 5.59,106.68 JP2.9
  Bottom Layer w0.5: v1(44.7,8.38) 44.7,10.92 UART5.1
PD2: length 129.5
  Top Layer w0.5: JP2.8 35.05,113.54 38.86,109.73 38.86,23.62 v1(39.37,23.11)
  Bottom Layer w0.5: UART5.2 48.51,13.97 v1(39.37,23.11)
PD12: length 33.6
  Bottom Layer w0.5: JP1.23 56.64,91.95 56.64,90.17 57.4,89.41 59.94,89.41 64.26,85.09 75.44,85.09 75.44,82.78 MOTOR3.4
PD13: length 44.4
  Bottom Layer w0.5: JP1.24 64.77,86.36 86.11,86.36 86.11,81.3 MOTOR3.3
PE9: length 123.5
  Top Layer w0.5: v1(63.75,16.51) 57.15,23.11 57.15,36.32 45.47,48.01 45.47,96.01 48.51,99.06 51.05,99.06 JP1.15 ; v1(66.55,16.51) 75.18,25.15 75.18,28.96 76.71,30.48 DATA_ABC1.5
  Bottom Layer w0.5: v1(63.75,16.51) v1(66.55,16.51)
PE11: length 98.3
  Top Layer w0.5: v1(64.26,21.08) 64.26,92.46 60.96,95.76 JP1.22
  Bottom Layer w0.5: DATA_ABC1.7 76.45,25.15 76.45,22.86 74.68,21.08 v1(64.26,21.08)
PE13: length 112.9
  Top Layer w0.5: v1(70.1,18.54) 76.96,25.4 DATA_ABC1.9 ; JP1.17 52.07,97.54 48.51,97.54 46.74,95.76 46.74,48.51 58.42,36.83 58.42,24.64 v1(64.52,18.54)
  Bottom Layer w0.5: v1(70.1,18.54) v1(64.52,18.54)
PE14: length 95.7
  Top Layer w0.5: JP1.18 62.23,100.84 65.02,98.04 v1(65.02,20.07) ; DATA_D1.10 71.12,25.15 71.12,23.62 v1(67.56,20.07)
  Bottom Layer w0.5: v1(65.02,20.07) v1(67.56,20.07)
PF0: length 113.6
  Top Layer w0.5: I2C2.2 65.84,12.75 65.84,116.28 63.5,118.62 JP1.4
PF1: length 122.3
  Top Layer w0.5: I2C2.1 62.48,16 55.88,22.61 55.88,35.81 44.2,47.5 44.2,113.28 49.53,118.62 JP1.3
PG9: length 100.7
  Top Layer w0.5: JP2.30 34.8,63.25 v1(34.8,37.34) ; UART6.2 56.64,17.27 53.85,20.07 53.85,33.27 v1(49.78,37.34)
  Bottom Layer w0.5: v1(34.8,37.34) v1(49.78,37.34)
PG14: length 73.9
  Top Layer w0.5: JP2.44 30.23,50.04 v1(30.23,38.86) ; v1(50.04,15.49) 53.59,11.94 UART6.1
  Bottom Layer w0.5: v1(50.04,15.49) 49.28,15.49 42.42,22.36 42.42,26.67 v1(30.23,38.86)
